# EasyEDA Pro project ProPrj_ESP32辉光钟_2025-08-24.epro, schematic IN12x4CTRL

## Sheets
1 power170VLM3478: Board Name: IN12x4CTRL; Create Date: 2025-08-04; Page Name: power170VLM3478; Project Name: ESP32辉光钟; Schematic Name: IN12x4CTRL; Update Date: 2025-08-04; Add into BOM: yes; Company: Your Company; Convert to PCB: yes; Date: 2023-03-07; Draw By: mkonhy; REV: 1.0; Sheet: 1/1
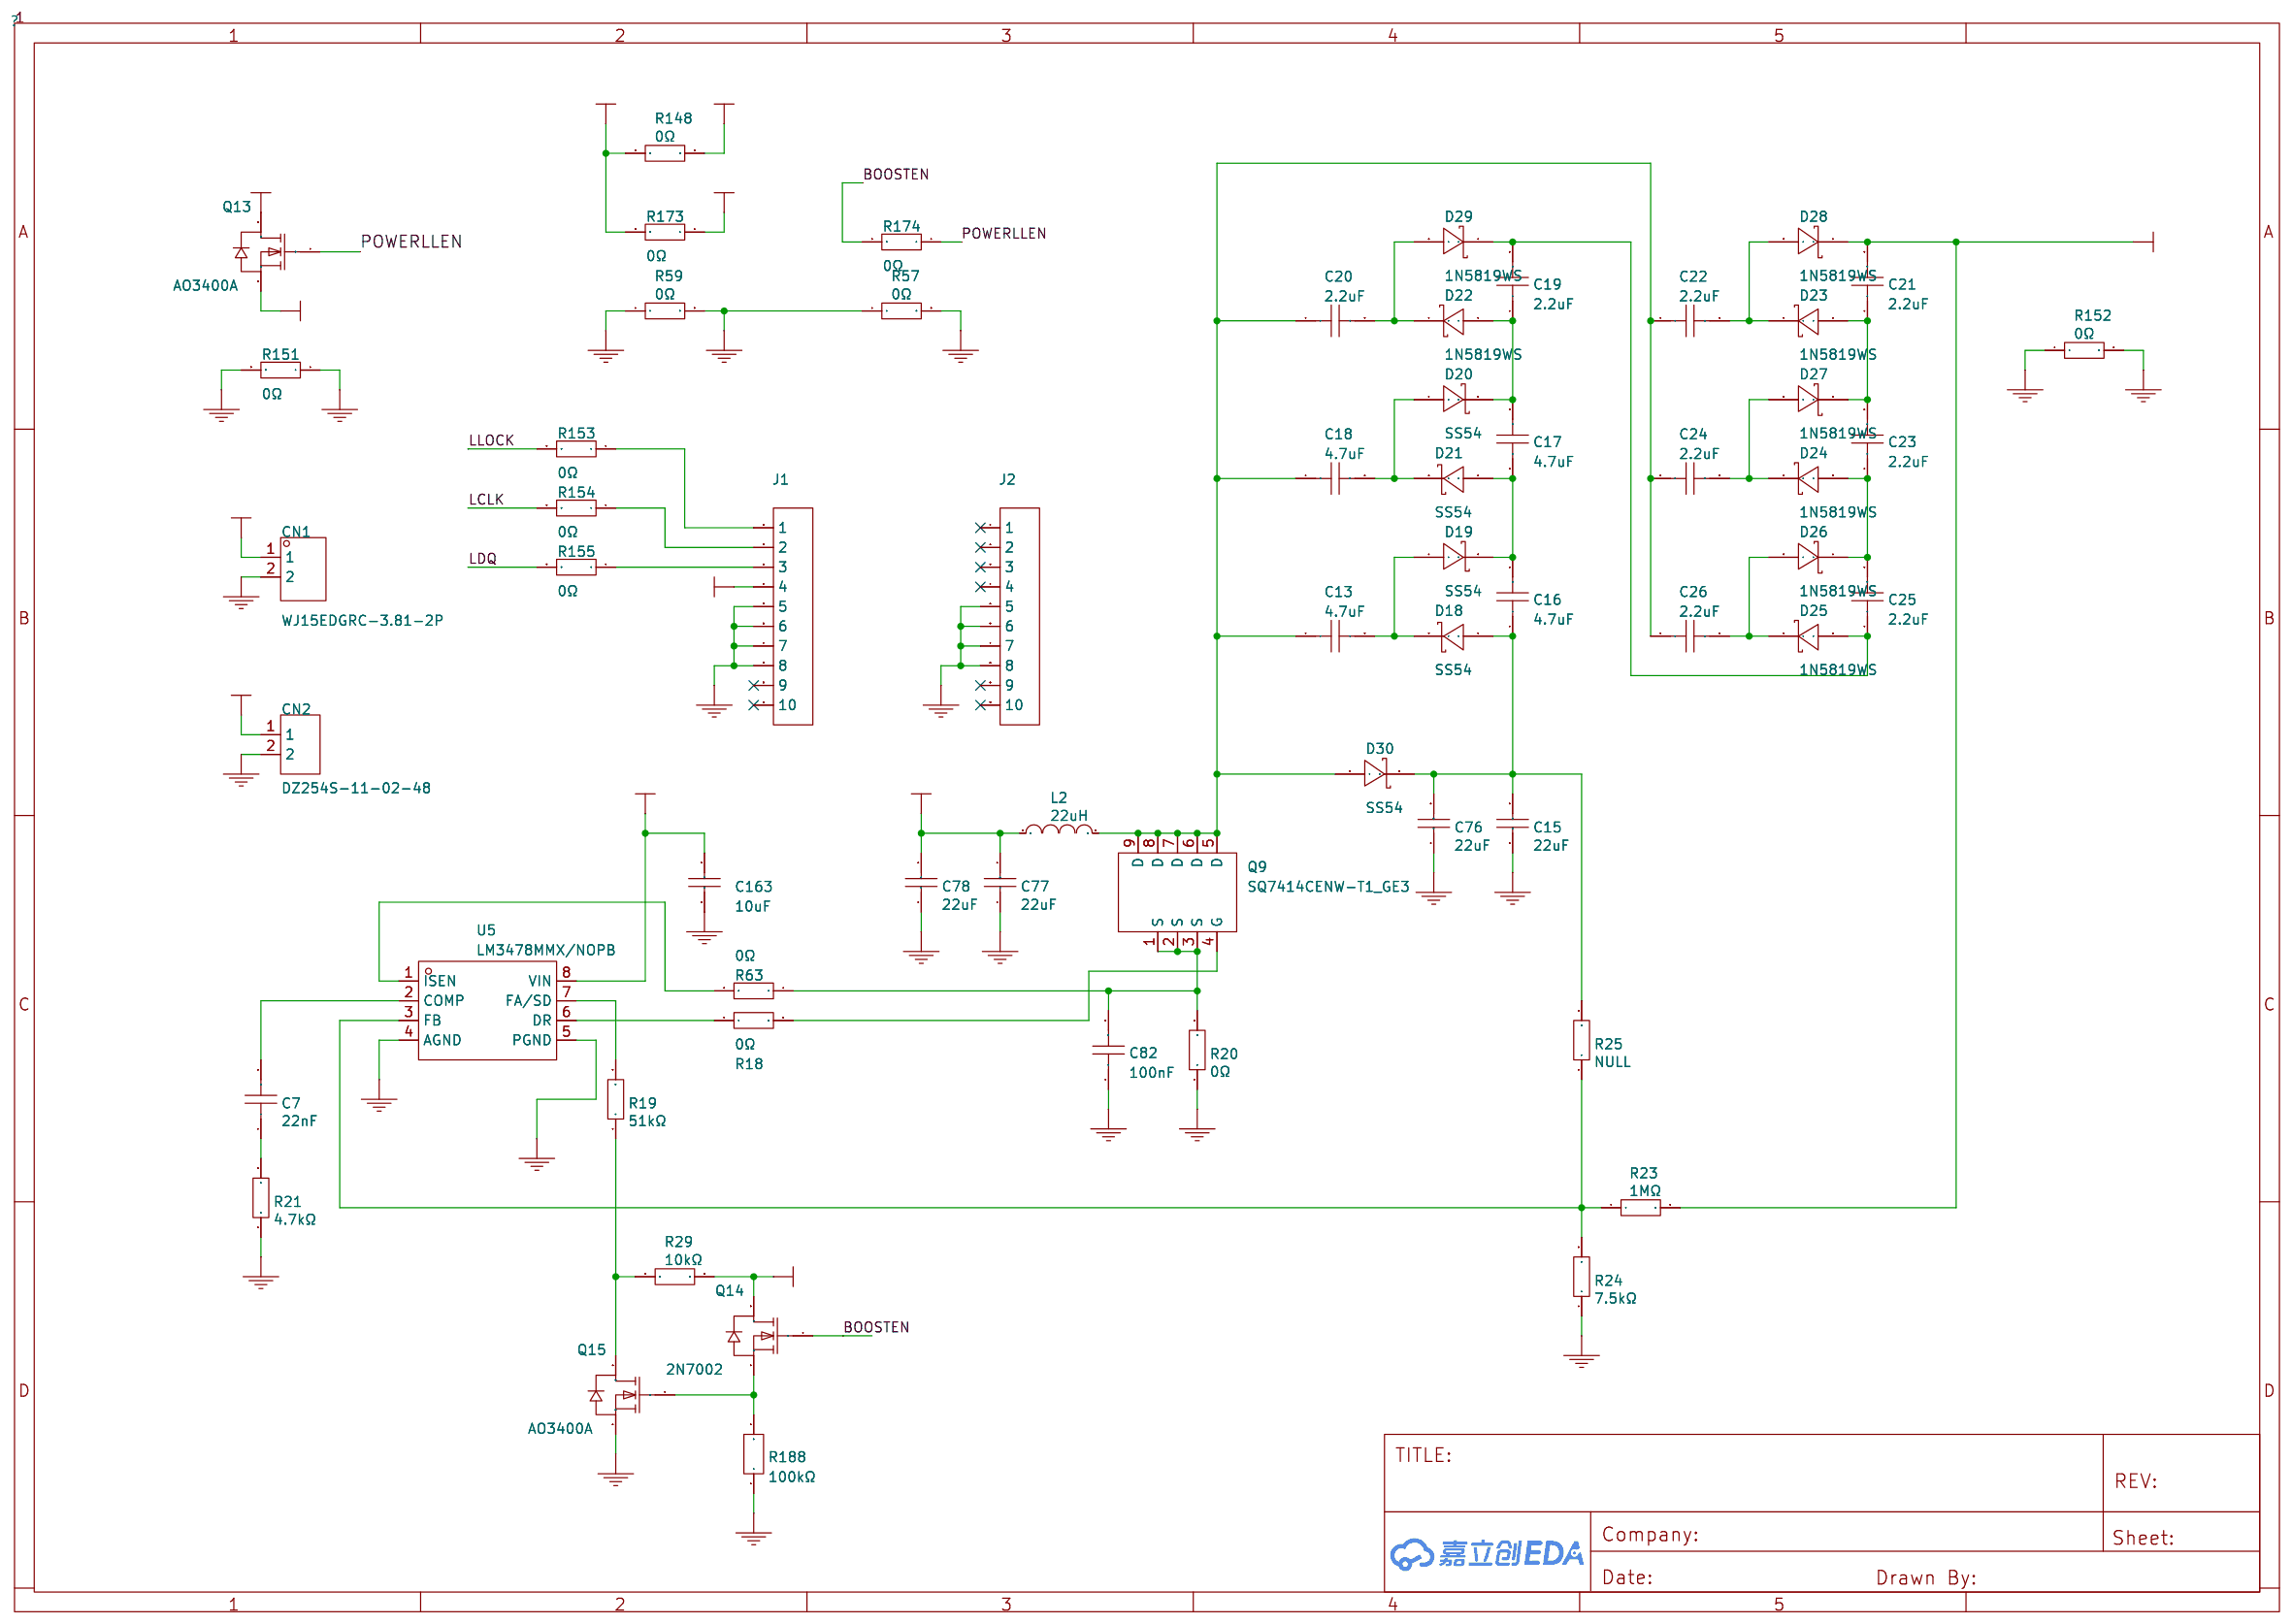
[diagram p2: power170VLM3478]
2 MCUESP32C3FH4: Page Name: MCUESP32C3FH4; Update Date: 2025-08-21; Company: 嘉立创EDA; Page Size: A4; Version: V1.0
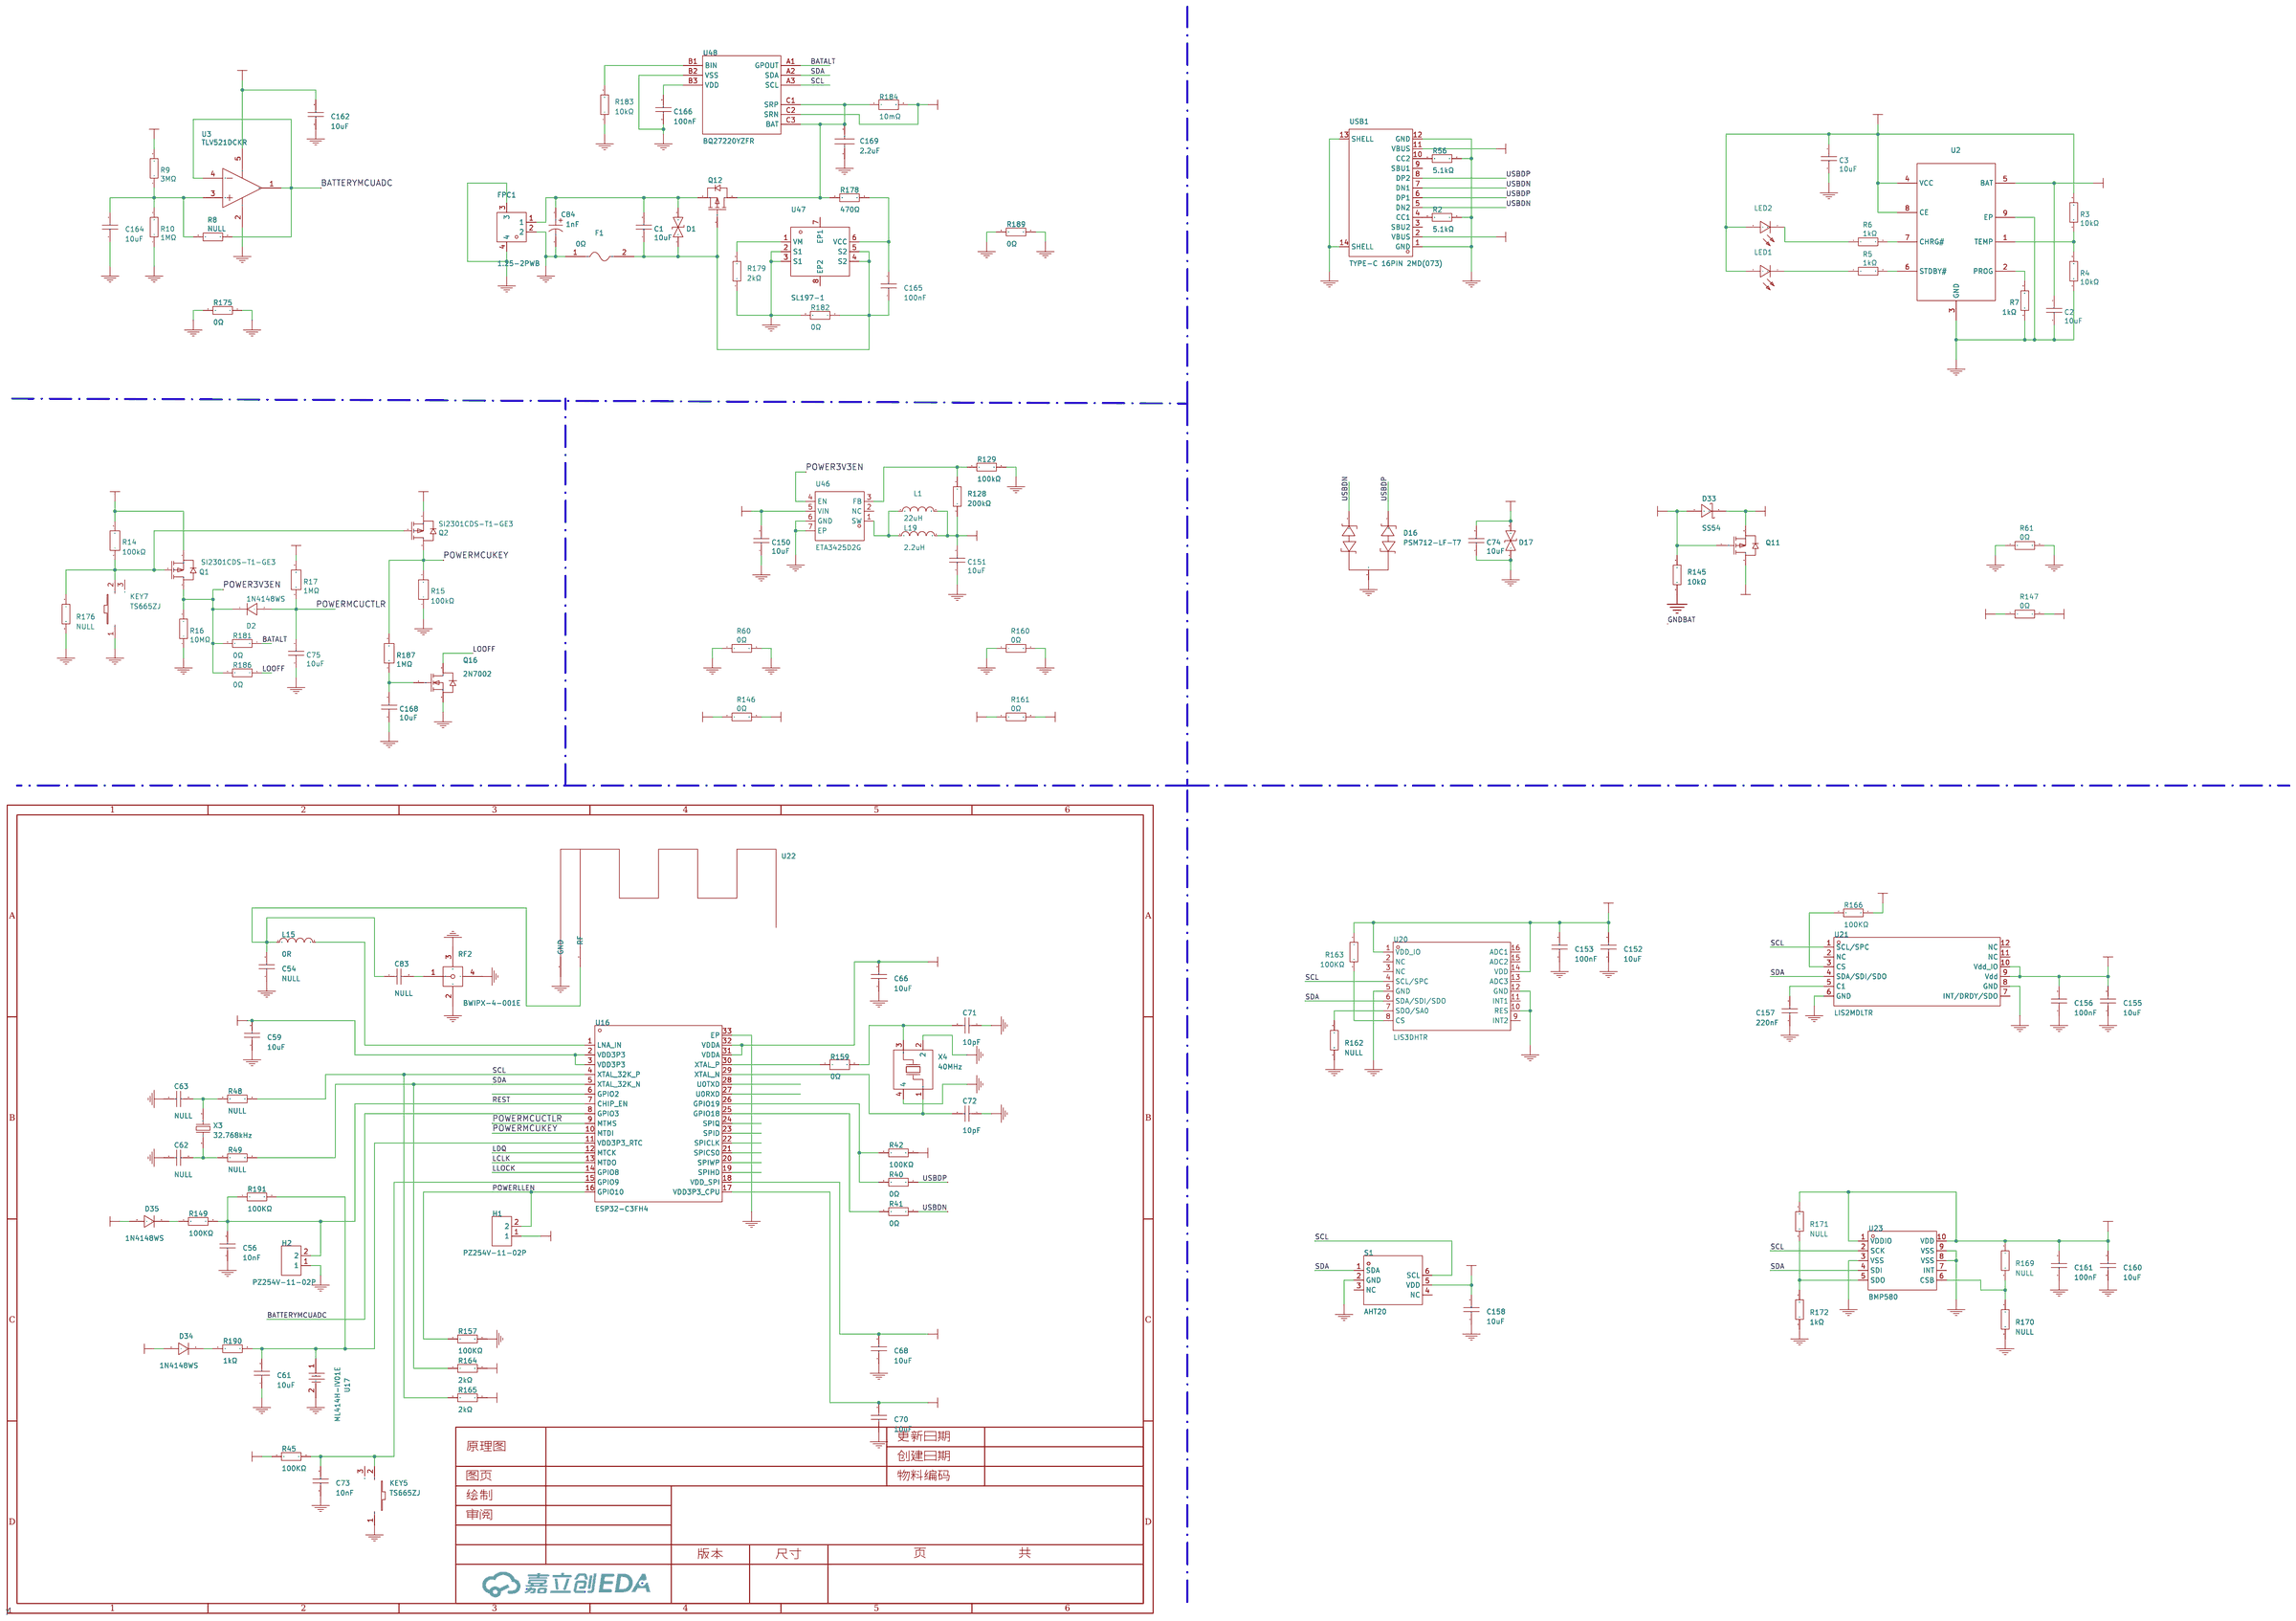
[diagram p3: MCUESP32C3FH4]

## Parts
sheet MCUESP32C3FH4
C1  10uF  [C0603]
C2  10uF  [C0603]
C3  10uF  [C0603]
C54  NULL  [C0402]
C56  10nF  [C0402]
C59  10uF  [C0402]
C61  10uF  [C0402]
C62  NULL  [C0402]
C63  NULL  [C0402]
C66  10uF  [C0402]
C68  10uF  [C0402]
C70  10uF  [C0402]
C71  10pF  [C0402]
C72  10pF  [C0402]
C73  10nF  [C0402]
C74  10uF  [C0603]
C75  10uF  [C0603]
C83  NULL  [C0402]
C84  1nF  [C2211]
C150  10uF  [C0603]
C151  10uF  [C0603]
C152  10uF  [C0402]  (no BOM)
C153  100nF  [C0402]  (no BOM)
C155  10uF  [C0402]  (no BOM)
C156  100nF  [C0402]  (no BOM)
C157  220nF  [C0402]  (no BOM)
C158  10uF  [C0402]
C160  10uF  [C0402]
C161  100nF  [C0402]
C162  10uF  [C0402]  (no BOM)
C164  10uF  [C0402]  (no BOM)
C165  100nF  [C0402]
C166  100nF  [C0402]
C168  10uF  [C0603]
C169  2.2uF  [C0402]
D1  P6SMB6.8CA/TR13  [SMB_L4.6-W3.6-LS5.3-BI]
D2  1N4148WS  [SOD-323_L1.8-W1.3-LS2.5-RD]
D16  PSM712-LF-T7  [SOT-23-3_L3.0-W1.7-P0.95-LS2.9-BR]
D17  P6SMB6.8CA/TR13  [SMB_L4.6-W3.6-LS5.3-BI]
D33  SS54  [SMA_L4.4-W2.8-LS5.4-R-RD]
D34  1N4148WS  [SOD-323_L1.8-W1.3-LS2.5-RD]
D35  1N4148WS  [SOD-323_L1.8-W1.3-LS2.5-RD]
F1  0Ω  [R0603]
FPC1  1.25-2PWB  [CONN-SMD_2P-P1.25_DEALON_1.25-2PWB]
H1  PZ254V-11-02P  [HDR-TH_2P-P2.54-V-M]
H2  PZ254V-11-02P  [HDR-TH_2P-P2.54-V-M]
KEY5  TS665ZJ  [SW-TH_TS665ZJ]
KEY7  TS665ZJ  [SW-TH_TS665ZJ]
L1  22uH  [IND-SMD_L7.8-W7.0_FXC0630]
L15  0R  [L0402]
L19  2.2uH  [L0603]
LED1  A-SP192GW1D-D01-4T  [LED0603-RD]
LED2  KT-0603R  [LED0603-RD]
Q1  SI2301CDS-T1-GE3  [SOT-23-3_L3.0-W1.7-P0.95-LS2.9-BR]
Q2  SI2301CDS-T1-GE3  [SOT-23-3_L3.0-W1.7-P0.95-LS2.9-BR]
Q11  AO3401A  [SOT-23_L2.9-W1.3-P1.90-LS2.4-BR]
Q12  AO3401A  [SOT-23_L2.9-W1.3-P1.90-LS2.4-BR]
Q16  2N7002  [SOT-23-3_L2.9-W1.3-P1.90-LS2.4-BR]
R2  5.1kΩ  [R0402]
R3  10kΩ  [R0402]
R4  10kΩ  [R0402]
R5  1kΩ  [R0402]
R6  1kΩ  [R0402]
R7  1kΩ  [R0402]
R8  NULL  [R0402]  (no BOM)
R9  3MΩ  [R0402]  (no BOM)
R10  1MΩ  [R0402]  (no BOM)
R14  100kΩ  [R0402]
R15  100kΩ  [R0402]
R16  10MΩ  [R0603]
R17  1MΩ  [R0402]
R40  0Ω  [R0402]
R41  0Ω  [R0402]
R42  100KΩ  [R0402]
R45  100KΩ  [R0402]
R48  NULL  [R0402]
R49  NULL  [R0402]
R56  5.1kΩ  [R0402]
R60  0Ω  [R0603]
R61  0Ω  [R0603]
R128  200kΩ  [R0402]
R129  100kΩ  [R0402]
R145  10kΩ  [R0603]
R146  0Ω  [R0603]
R147  0Ω  [R0603]
R149  100KΩ  [R0402]
R157  100KΩ  [R0402]
R159  0Ω  [R0201]
R160  0Ω  [R0603]
R161  0Ω  [R0603]
R162  NULL  [R0402]  (no BOM)
R163  100KΩ  [R0402]  (no BOM)
R164  2kΩ  [R0402]
R165  2kΩ  [R0402]
R166  100KΩ  [R0402]  (no BOM)
R169  NULL  [R0402]
R170  NULL  [R0402]
R171  NULL  [R0402]
R172  1kΩ  [R0402]
R175  0Ω  [R0402]  (no BOM)
R176  NULL  [R0402]
R178  470Ω  [R0402]
R179  2kΩ  [R0402]
R181  0Ω  [R0402]
R182  0Ω  [R0603]
R183  10kΩ  [R0402]
R184  10mΩ  [R0603]
R186  0Ω  [R0402]
R187  1MΩ  [R0402]
R189  0Ω  [R0603]
R190  1kΩ  [R0402]
R191  100KΩ  [R0402]
RF2  BWIPX-4-001E  [IPEX-SMD_BWIPX-4-001E]
S1  AHT20  [SENSOR-SMD_L3.0-W3.0-P1.00-BR]
U2  TP4056-42-ESOP8  [ESOP-8_L4.9-W3.9-P1.27-LS6.0-BL-EP]
U3  TLV521DCKR  [SC-70-5_L2.1-W1.3-P0.65-LS2.1-BR]  (no BOM)
U16  ESP32-C3FH4  [QFN-32_L5.0-W5.0-P0.50-TL-EP3.7]
U17  ML414H-IV01E  [BAT-SMD_ML414H-IV01E]
U20  LIS3DHTR  [LGA-16_L3.0-W3.0-P0.50-TL]  (no BOM)
U21  LIS2MDLTR  [LGA-12_L2.0-W2.0-P0.50-BL]  (no BOM)
U22  -  [2.4G天线]
U23  BMP580  [LGA-10_L2.0-W2.0-P0.50-TL_BMP580]
U46  ETA3425D2G  [TDFN-6_L2.0-W2.0-P0.65-TL-EP]
U47  SL197-1  [DFN-6L_L2.0-W2.0-P0.65-BL_SL197-1]
U48  BQ27220YZFR  [DSBGA-9_L1.7-W1.6-R3-C3-P0.50-BL]
USB1  TYPE-C 16PIN 2MD(073)  [USB-C-SMD_TYPE-C-6PIN-2MD-073]
X3  32.768kHz  [FC-135R_L3.2-W1.5]
X4  40MHz  [CRYSTAL-SMD_4P-L2.5-W2.0-BL]
sheet power170VLM3478
C7  22nF  [C0402]
C13  4.7uF  [C1206]
C15  22uF  [C1206]
C16  4.7uF  [C1206]
C17  4.7uF  [C1206]
C18  4.7uF  [C1206]
C19  2.2uF  [C0805]
C20  2.2uF  [C0805]
C21  2.2uF  [C0805]
C22  2.2uF  [C0805]
C23  2.2uF  [C0805]
C24  2.2uF  [C0805]
C25  2.2uF  [C0805]
C26  2.2uF  [C0805]
C76  22uF  [C1206]
C77  22uF  [C1206]
C78  22uF  [C1206]
C82  100nF  [C0402]
C163  10uF  [C0402]
CN1  WJ15EDGRC-3.81-2P  [CONN-TH_2P-P3.81_WJ15EDGRC-3.81-2P]  (no BOM)
CN2  DZ254S-11-02-48  [HDR-SMD_2P-P2.54_XKB_X6511WVS-02H-C60D48R2]
D18  SS54  [SMA_L4.4-W2.8-LS5.4-R-RD]
D19  SS54  [SMA_L4.4-W2.8-LS5.4-R-RD]
D20  SS54  [SMA_L4.4-W2.8-LS5.4-R-RD]
D21  SS54  [SMA_L4.4-W2.8-LS5.4-R-RD]
D22  1N5819WS  [SOD-323_L1.8-W1.3-LS2.5-RD]
D23  1N5819WS  [SOD-323_L1.8-W1.3-LS2.5-RD]
D24  1N5819WS  [SOD-323_L1.8-W1.3-LS2.5-RD]
D25  1N5819WS  [SOD-323_L1.8-W1.3-LS2.5-RD]
D26  1N5819WS  [SOD-323_L1.8-W1.3-LS2.5-RD]
D27  1N5819WS  [SOD-323_L1.8-W1.3-LS2.5-RD]
D28  1N5819WS  [SOD-323_L1.8-W1.3-LS2.5-RD]
D29  1N5819WS  [SOD-323_L1.8-W1.3-LS2.5-RD]
D30  SS54  [SMA_L4.4-W2.8-LS5.4-R-RD]
J1  2.54-1*10P针  [HDR-TH_10P-P2.54-V-M-1]
J2  2.54-1*10P针  [HDR-TH_10P-P2.54-V-M-1]
L2  22uH  [IND-SMD_L7.8-W7.0_FXC0630]
Q9  SQ7414CENW-T1_GE3  [POWERPAK-1212-8_L3.3-W3.3-P0.65-BL-EP]
Q13  AO3400A  [SOT-23-3_L2.9-W1.3-P1.90-LS2.4-BR]
Q14  2N7002  [SOT-23-3_L2.9-W1.3-P1.90-LS2.4-BR]
Q15  AO3400A  [SOT-23-3_L2.9-W1.3-P1.90-LS2.4-BR]
R18  0Ω  [R0603]
R19  51kΩ  [R0402]
R20  0Ω  [R0805]
R21  4.7kΩ  [R0402]
R23  1MΩ  [R1206]
R24  7.5kΩ  [R0603]
R25  NULL  [R0402]
R29  10kΩ  [R0402]
R57  0Ω  [R0603]
R59  0Ω  [R0603]
R63  0Ω  [R0402]
R148  0Ω  [R0603]
R151  0Ω  [R0603]
R152  0Ω  [R0603]
R153  0Ω  [R0402]
R154  0Ω  [R0402]
R155  0Ω  [R0402]
R173  0Ω  [R0402]
R174  0Ω  [R0402]
R188  100kΩ  [R0402]
U5  LM3478MMX/NOPB  [VSSOP-8_L3.0-W3.0-P0.65-LS5.0-BL]

## Library data of the parts
C1-C3 C74 C75 C150 C151 C168 = CL10A106MA8NRNC: 容值:10uF;精度:±20%;额定电压:25V;材质(温度系数):X5R;; LCSC Part Name: 10uF ±20% 25V; Supplier Part: C96446; Manufacturer: SAMSUNG(三星); Supplier Footprint: 0603; JLCPCB Part Class: Basic Part; Datasheet: https://atta.szlcsc.com/upload/public/pdf/source/20160218/1457707763339.pdf; Supplier: LCSC; Tolerance: ±20%; Voltage Rated: 25V; Temperature Coefficient: X5R
C54 C56 C62 C63 C73 C83 = 0402CG101J500NT: 容值:100pF;精度:±5%;额定电压:50V;材质(温度系数):C0G;; LCSC Part Name: 100pF ±5% 50V; Supplier Part: C1546; Manufacturer: FH(风华); Supplier Footprint: 0402; JLCPCB Part Class: 基础库; Datasheet: https://atta.szlcsc.com/upload/public/pdf/source/20200305/C486355_26A10D38EF8C2A5C37091D0039909270.pdf; Supplier: LCSC; Tolerance: ±5%; Voltage Rated: 50V; Temperature Coefficient: C0G
C59 C61 C66 C68 C70 C152 C155 C158 C160 C162-C164 = CL05A106MQ5NUNC: 容值:10uF;精度:±20%;额定电压:6.3V;材质(温度系数):X5R;; LCSC Part Name: 10uF ±20% 6.3V; Supplier Part: C15525; Manufacturer: SAMSUNG(三星); Supplier Footprint: 0402; JLCPCB Part Class: Basic Part; Datasheet: https://atta.szlcsc.com/upload/public/pdf/source/20220823/2B02EE04F8F211D38A52DCB16EB6BEBA.pdf; Supplier: LCSC; Tolerance: ±20%; Voltage Rated: 6.3V; Temperature Coefficient: X5R
C71 C72 = CL05C100JB5NNNC: 容值:10pF;精度:±5%;额定电压:50V;材质(温度系数):C0G;; LCSC Part Name: 10pF ±5% 50V; Supplier Part: C32949; Manufacturer: SAMSUNG(三星); Supplier Footprint: 0402; JLCPCB Part Class: Basic Part; Datasheet: https://atta.szlcsc.com/upload/public/pdf/source/20160218/1457707763339.pdf; Supplier: LCSC; Tolerance: ±5%; Voltage Rated: 50V; Temperature Coefficient: C0G
C84 = GA352QR7GF102KW01L: 容值:1nF;精度:±10%;电压(AC):250V;等级:X1,Y2;; LCSC Part Name: 等级:X1,Y2 1nF ±10% 250V; Supplier Part: C91599; Manufacturer: muRata(村田); Supplier Footprint: 2211; JLCPCB Part Class: Extended Part; Datasheet: https://atta.szlcsc.com/upload/public/pdf/source/20161226/1482720173745.pdf; Supplier: LCSC; Tolerance: ±10%; Voltage(AC): 250V; Subclass: X1,Y2; Operating Temperature: -55℃~+125℃
C82 C153 C156 C161 C165 C166 = CL05B104KB54PNC: 容值:100nF;精度:±10%;额定电压:50V;材质(温度系数):X7R;; LCSC Part Name: 100nF ±10% 50V; Supplier Part: C307331; Manufacturer: SAMSUNG(三星); Supplier Footprint: 0402; JLCPCB Part Class: Basic Part; Datasheet: https://atta.szlcsc.com/upload/public/pdf/source/20160218/1457707763339.pdf; Supplier: LCSC; Tolerance: ±10%; Voltage Rated: 50V; Temperature Coefficient: X7R
C157 = CL05B224KO5NNNC: 容值:220nF;精度:±10%;额定电压:16V;材质(温度系数):X7R;; LCSC Part Name: 220nF ±10% 16V; Supplier Part: C16772; Manufacturer: SAMSUNG(三星); Supplier Footprint: 0402; JLCPCB Part Class: Basic Part; Datasheet: https://atta.szlcsc.com/upload/public/pdf/source/20160218/1457707763339.pdf; Supplier: LCSC; Tolerance: ±10%; Voltage Rated: 16V; Temperature Coefficient: X7R
C169 = CL05A225MQ5NSNC: 容值:2.2uF;精度:±20%;额定电压:6.3V;材质(温度系数):X5R;; LCSC Part Name: 2.2uF ±20% 6.3V; Supplier Part: C12530; Manufacturer: SAMSUNG(三星); Supplier Footprint: 0402; JLCPCB Part Class: 基础库; Datasheet: https://atta.szlcsc.com/upload/public/pdf/source/20160218/1457707763339.pdf; Supplier: LCSC; Tolerance: ±20%; Voltage Rated: 6.3V; Temperature Coefficient: X5R
D1 D17 = P6SMB6.8CA/TR13: 反向截止电压(Vrwm):5.8V;最大钳位电压:10.5V;峰值脉冲电流(Ipp)@10/1000us:58.1A;峰值脉冲功率(Ppp)@10/1000us:600W;击穿电压:6.45V;; Supplier Part: C78395; Manufacturer: Brightking(君耀电子); Supplier Footprint: SMB(DO-214AA); JLCPCB Part Class: Basic Part; Datasheet: https://atta.szlcsc.com/upload/public/pdf/source/20160709/1468031879762.pdf; Supplier: LCSC; Reverse Stand-Off Voltage (Vrwm): 5.8V; Maximum Clamping Voltage: 10.5V; Peak Pulse Current (Ipp)@10/1000us: 58.1A; Peak Pulse Power Dissipation (Ppp)@10/1000us: 600W; Breakdown Voltage: 6.45V; Type: TVS
D2 D34 D35 = 1N4148WS_C2128: 二极管配置:独立式;正向压降(Vf):1.25V@150mA;直流反向耐压(Vr):100V;平均整流电流(Io):150mA;功率:200mW;反向恢复时间(trr):4ns;; LCSC Part Name: 电压:100V 电流:150mA; Supplier Part: C2128; Manufacturer: CJ(江苏长电/长晶); Supplier Footprint: SOD-323; JLCPCB Part Class: Basic Part; Datasheet: https://atta.szlcsc.com/upload/public/pdf/source/20140809/1457707208178.pdf; Supplier: LCSC; Diode Configuration: 独立式; Forward Voltage (Vf@If): 1.25V@150mA; Reverse Voltage (Vr): 100V; Average Rectified Current (Io): 150mA; Power Dissipation: 200mW; Reverse Leakage Current: 1uA@75V; Reverse Recovery Time (trr): 4ns
D16 = PSM712-LF-T7: 反向截止电压(Vrwm):12V;最大钳位电压:19V;击穿电压:13.3V;; Supplier Part: C32677; Manufacturer: PROTEK; Supplier Footprint: SOT-23; JLCPCB Part Class: 基础库; Datasheet: https://atta.szlcsc.com/upload/public/pdf/source/20140717/1457707154667.pdf; Supplier: LCSC; Reverse Stand-Off Voltage (Vrwm): 12V; Maximum Clamping Voltage: 19V; Breakdown Voltage: 13.3V; Type: TVS
D18-D21 D30 D33 = SS54_C22452: 二极管配置:独立式;正向压降(Vf):550mV@5A;直流反向耐压(Vr):40V;整流电流:5A;; LCSC Part Name: 电压:40V 电流:5A; Supplier Part: C22452; Manufacturer: MDD(辰达半导体); Supplier Footprint: SMA(DO-214AC); JLCPCB Part Class: 基础库; Datasheet: https://atta.szlcsc.com/upload/public/pdf/source/20230314/529CD85F9B31F69841D3A079BC07E377.pdf; Supplier: LCSC; Diode Configuration: 独立式; Forward Voltage (Vf@If): 550mV@5A; Reverse Voltage (Vr): 40V; Rectified Current: 5A; Reverse Leakage Current (Ir): 1mA@40V
F1 = 0603WAF0000T5E: 电阻类型:厚膜电阻;阻值:0Ω;精度:±1%;功率:100mW;工作电压:75V;; LCSC Part Name: 0Ω ±1% 100mW 厚膜电阻; Supplier Part: C21189; Manufacturer: UNI-ROYAL(厚声); Supplier Footprint: 0603; JLCPCB Part Class: Basic Part; Datasheet: https://atta.szlcsc.com/upload/public/pdf/source/20200306/C422600_1E6D84923E4A46A82E41ADD87F860B5C.pdf; Supplier: LCSC; Type: 厚膜电阻; Tolerance: ±1%; Power(Watts): 100mW; Overload Voltage (Max): 75V; Operating Temperature Range: -55℃~+155℃; Voltage-Supply(Max): 75V; Operating Temperature: -55℃~+155℃
FPC1 = 1.25-2PWB: 插针结构:1x2P;间距:1.25mm;安装方式:卧贴;参考系列:-;总PIN数:2P;排数:1;每排PIN数:2;行距:-;额定电流:-;工作温度范围:-40℃~+85℃;; LCSC Part Name: 1x2P 间距:1.25mm 卧贴; Supplier Part: C2905009; Manufacturer: DEALON(德艺隆); Supplier Footprint: SMD,P=1.25mm,卧贴; JLCPCB Part Class: 扩展库; Datasheet: https://atta.szlcsc.com/upload/public/pdf/source/20231123/1AE0876AE9C7DCFC0D68EAC4CBA881B0.pdf; Supplier: LCSC; Pins Structure: 1x2P; Pitch: 1.25mm; Mounting Style: 卧贴; Number of Pins: 2P; Number of Rows: 1; Number of PINs Per Row: 2; Operating Temperature Range: -40℃~+85℃
H1 H2 = PZ254V-11-02P: 插针结构:1x2P;间距:2.54mm;行距:-;圆针/方针:方针;安装类型:直插;排数:单排;总PIN位数:2P;额定电流:-;额定电压:-;配合针长度:6mm;塑高:2.5mm;端接针长度:3mm;触头材质:黄铜;触头镀层:-;工作温度范围:-40℃~+105℃;颜色:黑色;; LCSC Part Name: 间距:2.54mm 1x2P 直插 方针; Supplier Part: C492401; Manufacturer: XFCN(兴飞); Supplier Footprint: 插件,P=2.54mm; JLCPCB Part Class: Extended Part; Datasheet: https://atta.szlcsc.com/upload/public/pdf/source/20200309/C492401_A812433581A9B211A7FFA413ADDFF0E5.pdf; Supplier: LCSC; Pin Structure: 1x2P; Pitch: 2.54mm; Circluar Pins/Square Pins: 方针; Mounting Type: 直插; Number of Rows: 单排; Number of Pins: 2P; Length of Mating Pin: 6mm; Insulation Height: 2.5mm; Length of End Connection Pin: 3mm; Contact Material: 黄铜; Operating Temperature Range: -40℃~+105℃; Color: 黑色
KEY5 KEY7 = TS665ZJ: 电路结构:单刀单掷;按钮形状:圆形按钮;作用力:250gf;安装方式:卧插;开关长度:6.2mm;开关宽度:6.2mm;开关高度:5mm;带支架:带支架;触点电流:50mA;额定电压(DC):12V;绝缘电阻:100MΩ;机械寿命:5万次;; LCSC Part Name: 6.2*6.2*5mm 卧插 轻触开关; Supplier Part: C557599; Manufacturer: SHOU HAN(首韩); Supplier Footprint: 插件; JLCPCB Part Class: Extended Part; Datasheet: https://atta.szlcsc.com/upload/public/pdf/source/20200519/C557599_C93058E34E1879225DC935A3AAEF7EAA.pdf; Supplier: LCSC; Circuit: 单刀单掷; Actuator Style: 圆形按钮; Operating Force: 250gf; Mounting Style: 卧插; Switch Length: 6.2mm; Switch Width: 6.2mm; Switch Height: 5mm; Strike Gundam: 带支架; Contact Current: 50mA; Voltage Rating (DC): 12V; Insulation Resistance: 100MΩ; Actuator/Cap Color: 黑色; Pin Style: PC引脚; Mechanical Life: 5万次
L1 L2 = FXC0630-220M: 电感值:22uH;精度:±20%;额定电流:2A;饱和电流(Isat):3.5A;类型:一体成型电感;; LCSC Part Name: 22uH ±20% 3.5A; Supplier Part: C208103; Manufacturer: cjiang(长江微电); Supplier Footprint: SMD,6.6x7.3mm; JLCPCB Part Class: Extended Part; Datasheet: https://atta.szlcsc.com/upload/public/pdf/source/20230516/161B026EB2AA79E989878650F338970F.pdf; Supplier: LCSC; Tolerance: ±20%; Rated Current: 2A; Saturation Current (Isat): 3.5A; DC Resistance (DCR): 190mΩ; Type: 一体成型电感
L15 = LQP15MN2N0B02D: 电感值:2nH;精度:-;额定电流:220mA;饱和电流(Isat):-;直流电阻(DCR):300mΩ;; LCSC Part Name: 2nH; Supplier Part: C91619; Manufacturer: muRata(村田); Supplier Footprint: 0402; JLCPCB Part Class: 扩展库; Datasheet: https://atta.szlcsc.com/upload/public/pdf/source/20161226/1482720178678.pdf; Supplier: LCSC; Rated Current: 220mA; DC Resistance (DCR): 300mΩ; Q @ Freq: 13@500MHz; Frequency - Self Resonant: 6GHz
L19 = CMH160808B2R2MT: 电感值:2.2uH;精度:±20%;额定电流:750mA;; LCSC Part Name: 2.2uH ±20%; Supplier Part: C394950; Manufacturer: FH(风华); Supplier Footprint: 0603; JLCPCB Part Class: Extended Part; Datasheet: https://atta.szlcsc.com/upload/public/pdf/source/20230223/142B566F7A79878A07A1E031813F1064.pdf; Supplier: LCSC; Tolerance: ±20%; Rated Current: 750mA; DC Resistance (DCR): 240mΩ; Ratings: AEC-Q200
LED1 = A-SP192GW1D-D01-4T: 发光颜色:白色;正向电压(VF):2.5V~2.9V;功率:95mW;透镜颜色:-;发光强度:57mcd~225mcd;发光角度:130°;载带方式:正贴;工作温度:-40℃~+85℃;; LCSC Part Name: 0603白光正贴（正白偏冷）; Supplier Part: C19171285; Manufacturer: Amicc(欧密格光电); Supplier Footprint: 0603; JLCPCB Part Class: Extended Part; Datasheet: https://atta.szlcsc.com/upload/public/pdf/source/20231108/C509B7BEC9EA0B1CC79F1E6D714E882A.pdf; Supplier: LCSC; Emitted Color: 白色; Forward Voltage (VF): 2.5V~2.9V; Power Dissipation: 95mW; Luminous Intensity: 57mcd~225mcd; Viewing Angle: 130°; Mounting Sytle: 正贴; Operating Temperature: -40℃~+85℃
LED2 = KT-0603R: 发光颜色:红色;功率:-;正向电流:-;主波长:-;二极管配置:-;透镜颜色:-;色温:-;发光角度:-;载带方式:-;工作温度:-40℃~+85℃;; LCSC Part Name: 0603 红灯 高亮; Supplier Part: C2286; Manufacturer: KENTO; Supplier Footprint: 0603; JLCPCB Part Class: Basic Part; Datasheet: https://atta.szlcsc.com/upload/public/pdf/source/20160616/1466072038404.pdf; Supplier: LCSC; Emitted Color: 红色; Operating Temperature: -40℃~+85℃
Q1 Q2 = SI2301CDS-T1-GE3: 数量:1个P沟道;漏源电压(Vdss):20V;连续漏极电流(Id):2.3A;导通电阻(RDS(on)):112mΩ@4.5V,2.8A;耗散功率(Pd):860mW;阈值电压(Vgs(th)):1V;; LCSC Part Name: 1个P沟道 耐压:20V 电流:3.1A; Supplier Part: C10487; Manufacturer: VISHAY(威世); Supplier Footprint: SOT-23; JLCPCB Part Class: Basic Part; Datasheet: https://atta.szlcsc.com/upload/public/pdf/source/20180621/C10487_757133A2CC00440C4C7DD3E7E73681E9.pdf; Supplier: LCSC; Type: 1个P沟道; Drain Source Voltage (Vdss): 20V; Continuous Drain Current (Id): 3.1A; Power Dissipation (Pd): 860mW；1.6W; Drain Source On Resistance (RDS(on)@Vgs,Id): 112mΩ@4.5V,2.8A; Gate Threshold Voltage (Vgs(th)@Id): 1V@250uA; Total Gate Charge (Qg@Vgs): 10nC@4.5V; Input Capacitance (Ciss@Vds): 405pF@10V; Operating Temperature: -55℃~+150℃@(Tj); Number: 1个P沟道; Drain to Source Voltage: 20V; Current - Continuous Drain(Id): 2.3A; RDS(on): 112mΩ@4.5V,2.8A; Pd - Power Dissipation: 860mW; Gate Charge(Qg): 3.3nC@10V; Input Capacitance(Ciss@Vds): 405pF@10V
Q11 Q12 = AO3401A_C15127: 类型:1个P沟道;漏源电压(Vdss):30V;连续漏极电流(Id):4A;导通电阻(RDS(on)@Vgs,Id):44mΩ@10V,4.3A;功率(Pd):1.4W;阈值电压(Vgs(th)@Id):1.3V@250uA;; LCSC Part Name: 1个P沟道 耐压:30V 电流:4A; Supplier Part: C15127; Manufacturer: AOS; Supplier Footprint: SOT-23; JLCPCB Part Class: 基础库; Datasheet: https://atta.szlcsc.com/upload/public/pdf/source/20160507/1462613609053.pdf; Supplier: LCSC; Type: 1个P沟道; Drain Source Voltage (Vdss): 30V; Continuous Drain Current (Id): 4A; Drain Source On Resistance (RDS(on)@Vgs,Id): 44mΩ@10V,4.3A; Power Dissipation (Pd): 1.4W; Gate Threshold Voltage (Vgs(th)@Id): 1.3V@250uA; Total Gate Charge (Qg@Vgs): 12.2nC@4.5V; Input Capacitance (Ciss@Vds): 1.2nF@15V; Operating Temperature: -55℃~+150℃@(Tj); Standardization Check: true
Q16 = 2N7002_C8545: 类型:N沟道;漏源电压(Vdss):60V;连续漏极电流(Id):115mA;功率(Pd):200mW;导通电阻(RDS(on)@Vgs,Id):7.5Ω@10V,500mA;阈值电压(Vgs(th)@Id):2.5V@250uA;; LCSC Part Name: N沟道 耐压:60V 电流:115mA; Supplier Part: C8545; Manufacturer: CJ(江苏长电/长晶); Supplier Footprint: SOT-23; JLCPCB Part Class: 基础库; Datasheet: https://atta.szlcsc.com/upload/public/pdf/source/20171228/C164913_15144413269051213916.pdf; Supplier: LCSC; Type: N沟道; Drain Source Voltage (Vdss): 60V; Continuous Drain Current (Id): 115mA; Power Dissipation (Pd): 200mW; Drain Source On Resistance (RDS(on)@Vgs,Id): 7.5Ω@10V,500mA; Gate Threshold Voltage (Vgs(th)@Id): 2.5V@250uA
R2 R56 = 0402WGF5101TCE: 电阻类型:厚膜电阻;阻值:5.1kΩ;精度:±1%;功率:62.5mW;最大工作电压:50V;温度系数:±100ppm/℃;; LCSC Part Name: 5.1kΩ ±1% 62.5mW 厚膜电阻; Supplier Part: C25905; Manufacturer: UNI-ROYAL(厚声); Supplier Footprint: 0402; JLCPCB Part Class: Basic Part; Datasheet: https://atta.szlcsc.com/upload/public/pdf/source/20200306/C422600_1E6D84923E4A46A82E41ADD87F860B5C.pdf; Supplier: LCSC; Type: 厚膜电阻; Tolerance: ±1%; Power(Watts): 62.5mW; Overload Voltage (Max): 50V; Temperature Coefficient: ±100ppm/℃; Operating Temperature Range: -55℃~+155℃
R3 R4 R29 R183 = 0402WGF1002TCE: 电阻类型:厚膜电阻;阻值:10kΩ;精度:±1%;功率:62.5mW;最大工作电压:50V;温度系数:±100ppm/℃;; LCSC Part Name: 10kΩ ±1% 62.5mW 厚膜电阻; Supplier Part: C25744; Manufacturer: UNI-ROYAL(厚声); Supplier Footprint: 0402; JLCPCB Part Class: Basic Part; Datasheet: https://atta.szlcsc.com/upload/public/pdf/source/20200306/C422600_1E6D84923E4A46A82E41ADD87F860B5C.pdf; Supplier: LCSC; Type: 厚膜电阻; Tolerance: ±1%; Power(Watts): 62.5mW; Overload Voltage (Max): 50V; Temperature Coefficient: ±100ppm/℃; Operating Temperature Range: -55℃~+155℃
R5-R7 = 0402WGF1001TCE: 电阻类型:厚膜电阻;阻值:1kΩ;精度:±1%;功率:62.5mW;最大工作电压:50V;温度系数:±100ppm/℃;; LCSC Part Name: 1kΩ ±1% 62.5mW 厚膜电阻; Supplier Part: C11702; Manufacturer: UNI-ROYAL(厚声); Supplier Footprint: 0402; JLCPCB Part Class: Basic Part; Datasheet: https://atta.szlcsc.com/upload/public/pdf/source/20200306/C422600_1E6D84923E4A46A82E41ADD87F860B5C.pdf; Supplier: LCSC; Type: 厚膜电阻; Tolerance: ±1%; Power(Watts): 62.5mW; Overload Voltage (Max): 50V; Temperature Coefficient: ±100ppm/℃; Operating Temperature Range: -55℃~+155℃
R8 = AC0402FR-071ML: Supplier: LCSC; Manufacturer: YAGEO(国巨); Supplier Part: C144787; JLCPCB Part Class: Extended Part; Resistance: 1MΩ
R9 = 0402WGF3004TCE: 电阻类型:厚膜电阻;阻值:3MΩ;精度:±1%;功率:62.5mW;最大工作电压:50V;温度系数:±100ppm/℃;; LCSC Part Name: 3MΩ ±1% 62.5mW 厚膜电阻; Supplier Part: C56582; Manufacturer: UNI-ROYAL(厚声); Supplier Footprint: 0402; JLCPCB Part Class: Extended Part; Datasheet: https://atta.szlcsc.com/upload/public/pdf/source/20200306/C422600_1E6D84923E4A46A82E41ADD87F860B5C.pdf; Supplier: LCSC; Type: 厚膜电阻; Tolerance: ±1%; Power(Watts): 62.5mW; Overload Voltage (Max): 50V; Temperature Coefficient: ±100ppm/℃; Operating Temperature Range: -55℃~+155℃; Resistance: 3M
R10 R17 R187 = 0402WGF1004TCE: 电阻类型:厚膜电阻;阻值:1MΩ;精度:±1%;功率:62.5mW;最大工作电压:50V;温度系数:±100ppm/℃;; LCSC Part Name: 1MΩ ±1% 62.5mW 厚膜电阻; Supplier Part: C26083; Manufacturer: UNI-ROYAL(厚声); Supplier Footprint: 0402; JLCPCB Part Class: Basic Part; Datasheet: https://atta.szlcsc.com/upload/public/pdf/source/20200306/C422600_1E6D84923E4A46A82E41ADD87F860B5C.pdf; Supplier: LCSC; Type: 厚膜电阻; Tolerance: ±1%; Power(Watts): 62.5mW; Overload Voltage (Max): 50V; Temperature Coefficient: ±100ppm/℃; Operating Temperature Range: -55℃~+155℃
R14 R15 R129 R188 = 0402WGF1003TCE: 电阻类型:厚膜电阻;阻值:100kΩ;精度:±1%;功率:62.5mW;最大工作电压:50V;温度系数:±100ppm/℃;; LCSC Part Name: 100kΩ ±1% 62.5mW 厚膜电阻; Supplier Part: C25741; Manufacturer: UNI-ROYAL(厚声); Supplier Footprint: 0402; JLCPCB Part Class: Basic Part; Datasheet: https://atta.szlcsc.com/upload/public/pdf/source/20200306/C422600_1E6D84923E4A46A82E41ADD87F860B5C.pdf; Supplier: LCSC; Type: 厚膜电阻; Tolerance: ±1%; Power(Watts): 62.5mW; Overload Voltage (Max): 50V; Temperature Coefficient: ±100ppm/℃; Operating Temperature Range: -55℃~+155℃
R16 = 0603WAF1005T5E: 电阻类型:厚膜电阻;阻值:10MΩ;精度:±1%;功率:100mW;最大工作电压:75V;温度系数:±100ppm/℃;; LCSC Part Name: 10MΩ ±1% 100mW 厚膜电阻; Supplier Part: C7250; Manufacturer: UNI-ROYAL(厚声); Supplier Footprint: 0603; JLCPCB Part Class: Basic Part; Datasheet: https://atta.szlcsc.com/upload/public/pdf/source/20200306/C422600_1E6D84923E4A46A82E41ADD87F860B5C.pdf; Supplier: LCSC; Type: 厚膜电阻; Tolerance: ±1%; Power(Watts): 100mW; Overload Voltage (Max): 75V; Temperature Coefficient: ±100ppm/℃; Operating Temperature Range: -55℃~+155℃
R40-R42 R45 R48 R49 R149 R153-R155 R157 R163 R166 R175 R176 R181 R186 R191 = 0402WGF1004TCE: 电阻类型:厚膜电阻;阻值:1MΩ;精度:±1%;功率:62.5mW;最大工作电压:50V;温度系数:±100ppm/℃;; LCSC Part Name: 1MΩ ±1% 62.5mW 厚膜电阻; Supplier Part: C26083; Manufacturer: UNI-ROYAL(厚声); Supplier Footprint: 0402; JLCPCB Part Class: 基础库; Datasheet: https://atta.szlcsc.com/upload/public/pdf/source/20200306/C422600_1E6D84923E4A46A82E41ADD87F860B5C.pdf; Supplier: LCSC; Type: 厚膜电阻; Tolerance: ±1%; Power(Watts): 62.5mW; Overload Voltage (Max): 50V; Temperature Coefficient: ±100ppm/℃; Operating Temperature Range: -55℃~+155℃
R18 R57 R59-R61 R146-R148 R151 R152 R160 R161 R182 R189 = 0603WAF0000T5E: 电阻类型:厚膜电阻;阻值:0Ω;精度:±1%;功率:100mW;最大工作电压:75V;; LCSC Part Name: 0Ω ±1% 100mW 厚膜电阻; Supplier Part: C21189; Manufacturer: UNI-ROYAL(厚声); Supplier Footprint: 0603; JLCPCB Part Class: Basic Part; Datasheet: https://atta.szlcsc.com/upload/public/pdf/source/20200306/C422600_1E6D84923E4A46A82E41ADD87F860B5C.pdf; Supplier: LCSC; Type: 厚膜电阻; Tolerance: ±1%; Power(Watts): 100mW; Overload Voltage (Max): 75V; Operating Temperature Range: -55℃~+155℃; Resistance: 1
R128 = 0402WGF2003TCE: 电阻类型:厚膜电阻;阻值:200kΩ;精度:±1%;功率:62.5mW;最大工作电压:50V;温度系数:±100ppm/℃;; LCSC Part Name: 200kΩ ±1% 62.5mW 厚膜电阻; Supplier Part: C25764; Manufacturer: UNI-ROYAL(厚声); Supplier Footprint: 0402; JLCPCB Part Class: 基础库; Datasheet: https://atta.szlcsc.com/upload/public/pdf/source/20200306/C422600_1E6D84923E4A46A82E41ADD87F860B5C.pdf; Supplier: LCSC; Type: 厚膜电阻; Tolerance: ±1%; Power(Watts): 62.5mW; Overload Voltage (Max): 50V; Temperature Coefficient: ±100ppm/℃; Operating Temperature Range: -55℃~+155℃
R145 = 0603WAF1002T5E: 电阻类型:厚膜电阻;阻值:10kΩ;精度:±1%;功率:100mW;温度系数:±100ppm/℃;最大工作电压:75V;工作温度范围:-55℃~+155℃;; LCSC Part Name: 10kΩ ±1% 100mW; Supplier Part: C25804; Manufacturer: UNI-ROYAL(厚声); Supplier Footprint: 0603; JLCPCB Part Class: 基础库; Datasheet: https://atta.szlcsc.com/upload/public/pdf/source/20200306/C422600_1E6D84923E4A46A82E41ADD87F860B5C.pdf; Supplier: LCSC; Type: 厚膜电阻; Tolerance: ±1%; Power(Watts): 100mW; Temperature Coefficient: ±100ppm/℃; Overload Voltage (Max): 75V; Operating Temperature Range: -55℃~+155℃; Standardization Check: true
R159 = 0201WMF0000TEE: 电阻类型:厚膜电阻;阻值:0Ω;精度:±1%;功率:50mW;最大工作电压:25V;; LCSC Part Name: 0Ω ±1% 50mW 厚膜电阻; Supplier Part: C473473; Manufacturer: UNI-ROYAL(厚声); Supplier Footprint: 0201; JLCPCB Part Class: 扩展库; Datasheet: https://atta.szlcsc.com/upload/public/pdf/source/20200306/C422600_1E6D84923E4A46A82E41ADD87F860B5C.pdf; Supplier: LCSC; Type: 厚膜电阻; Tolerance: ±1%; Power(Watts): 50mW; Overload Voltage (Max): 25V; Operating Temperature Range: -55℃~+155℃
R162 R169-R171 = 0402WGJ0104TCE: 电阻类型:厚膜电阻;阻值:100kΩ;精度:±5%;功率:62.5mW;最大工作电压:50V;温度系数:±100ppm/℃;; LCSC Part Name: 100kΩ ±5% 62.5mW 厚膜电阻; Supplier Part: C25530; Manufacturer: UNI-ROYAL(厚声); Supplier Footprint: 0402; JLCPCB Part Class: Extended Part; Datasheet: https://atta.szlcsc.com/upload/public/pdf/source/20200306/C422600_1E6D84923E4A46A82E41ADD87F860B5C.pdf; Supplier: LCSC; Type: 厚膜电阻; Tolerance: ±5%; Power(Watts): 62.5mW; Overload Voltage (Max): 50V; Temperature Coefficient: ±100ppm/℃; Operating Temperature Range: -55℃~+155℃
R164 R165 = 0402WGF2001TCE: 电阻类型:厚膜电阻;阻值:2kΩ;精度:±1%;功率:62.5mW;最大工作电压:50V;温度系数:±100ppm/℃;; LCSC Part Name: 2kΩ ±1% 62.5mW 厚膜电阻; Supplier Part: C4109; Manufacturer: UNI-ROYAL(厚声); Supplier Footprint: 0402; JLCPCB Part Class: Basic Part; Datasheet: https://atta.szlcsc.com/upload/public/pdf/source/20200306/C422600_1E6D84923E4A46A82E41ADD87F860B5C.pdf; Supplier: LCSC; Type: 厚膜电阻; Tolerance: ±1%; Power(Watts): 62.5mW; Overload Voltage (Max): 50V; Temperature Coefficient: ±100ppm/℃; Operating Temperature Range: -55℃~+155℃
R172 R190 = 0402WGF1001TCE: 电阻类型:厚膜电阻;阻值:1kΩ;精度:±1%;功率:62.5mW;工作电压:50V;温度系数:±100ppm/℃;; LCSC Part Name: 1kΩ ±1% 62.5mW 厚膜电阻; Supplier Part: C11702; Manufacturer: UNI-ROYAL(厚声); Supplier Footprint: 0402; JLCPCB Part Class: Basic Part; Datasheet: https://item.szlcsc.com/datasheet/0402WGF1001TCE/12256.html; Supplier: LCSC; Type: 厚膜电阻; Tolerance: ±1%; Power(Watts): 62.5mW; Overload Voltage (Max): 50V; Temperature Coefficient: ±100ppm/℃; Operating Temperature Range: -55℃~+155℃; Voltage-Supply(Max): 50V; Operating Temperature: -55℃~+155℃
R178 = 0402WGF4700TCE: 电阻类型:厚膜电阻;阻值:470Ω;精度:±1%;功率:62.5mW;最大工作电压:50V;温度系数:±100ppm/℃;; LCSC Part Name: 470Ω ±1% 62.5mW 厚膜电阻; Supplier Part: C25117; Manufacturer: UNI-ROYAL(厚声); Supplier Footprint: 0402; JLCPCB Part Class: 基础库; Datasheet: https://atta.szlcsc.com/upload/public/pdf/source/20200306/C422600_1E6D84923E4A46A82E41ADD87F860B5C.pdf; Supplier: LCSC; Type: 厚膜电阻; Tolerance: ±1%; Power(Watts): 62.5mW; Overload Voltage (Max): 50V; Temperature Coefficient: ±100ppm/℃; Operating Temperature Range: -55℃~+155℃
R179 = 0402WGF2001TCE: 电阻类型:厚膜电阻;阻值:2kΩ;精度:±1%;功率:62.5mW;最大工作电压:50V;温度系数:±100ppm/℃;; LCSC Part Name: 2kΩ ±1% 62.5mW 厚膜电阻; Supplier Part: C4109; Manufacturer: UNI-ROYAL(厚声); Supplier Footprint: 0402; JLCPCB Part Class: 基础库; Datasheet: https://atta.szlcsc.com/upload/public/pdf/source/20200306/C422600_1E6D84923E4A46A82E41ADD87F860B5C.pdf; Supplier: LCSC; Type: 厚膜电阻; Tolerance: ±1%; Power(Watts): 62.5mW; Overload Voltage (Max): 50V; Temperature Coefficient: ±100ppm/℃; Operating Temperature Range: -55℃~+155℃
R184 = 0603WAJ010LT5E: 电阻类型:厚膜电阻;阻值:10mΩ;精度:±5%;功率:100mW;工作电压:75V;温度系数:±1500ppm/℃;; LCSC Part Name: 10mΩ ±5% 100mW 厚膜电阻; Supplier Part: C620909; Manufacturer: UNI-ROYAL(厚声); Supplier Footprint: 0603; JLCPCB Part Class: 扩展库; Datasheet: https://atta.szlcsc.com/upload/public/pdf/source/20200306/C422600_1E6D84923E4A46A82E41ADD87F860B5C.pdf; Supplier: LCSC; Type: 厚膜电阻; Tolerance: ±5%; Power(Watts): 100mW; Voltage-Supply(Max): 75V; Temperature Coefficient: ±1500ppm/℃; Operating Temperature: -55℃~+155℃
RF2 = BWIPX-4-001E: 连接器类型:板端;接口类型:内针;端口数量:1;接口直径:1.5mm;接口长度/高度:-;频率-最大值:-;射频系列:IPEX;阻抗:-;样式:-;工作温度范围:-;; LCSC Part Name: IPEX 内针; Supplier Part: C784401; Manufacturer: BAT WIRELESS(蝙蝠无线); Supplier Footprint: SMD; JLCPCB Part Class: 扩展库; Datasheet: https://atta.szlcsc.com/upload/public/pdf/source/20200915/C784401_F782AD355A18B33ABEEDBC6CC33688E9.pdf; Supplier: LCSC; Connector Type: 板端; Interface Type: 内针; Number of Ports: 1; Interface Diameter: 1.5mm; RF Series: IPEX
S1 = AHT20: Supplier Part: C2757850; Manufacturer: 广州奥松; Supplier Footprint: SMD; JLCPCB Part Class: Extended Part; Datasheet: https://atta.szlcsc.com/upload/public/pdf/source/20231023/00557B34ED120268320A4810FF8DED4D.pdf; Supplier: LCSC
U2 = TP4056-42-ESOP8: 锂电池充电芯片 42代表电池满电电压4.2V。; Supplier Part: C16581; Manufacturer: TOPPOWER(南京拓微); Supplier Footprint: ESOP-8; JLCPCB Part Class: Extended Part; Datasheet: https://atta.szlcsc.com/upload/public/pdf/source/20190626/C16581_611BCF5D7CF554EAE465137A8F68DB3E.pdf; Supplier: LCSC
U3 = TLV521DCKR: 放大器数:单路;增益带宽积(GBP):6kHz;输入偏置电流(Ib):1pA;压摆率(SR):0.0025V/us;带宽(-3db):-;轨到轨:-;; Supplier Part: C655085; Manufacturer: TI(德州仪器); Supplier Footprint: SC-70-5; JLCPCB Part Class: Extended Part; Datasheet: https://www.ti.com/cn/lit/gpn/tlv521; Supplier: LCSC; Number of Circuits: 单路; Gain Bandwidth Product(GBP): 6kHz; Current - Input Bias(Ib): 1pA; Slew Rate(SR): 0.0025V/us; Output Current: 12mA; Operating Temperature: -40℃~+125℃
U16 = ESP32-C3FH4: Supplier Part: C2858491; Manufacturer: ESPRESSIF(乐鑫); Supplier Footprint: QFN-32-EP(5x5); JLCPCB Part Class: 扩展库; Datasheet: https://atta.szlcsc.com/upload/public/pdf/source/20231220/86199E4714F7A99F6AA9401EA48CDBDA.pdf; Supplier: LCSC
U17 = ML414H-IV01E: 4.8*1.4 3.1V可充电纽扣电池/1mAh/可无铅回流焊; LCSC Part Name: Seiko(精工) 锂离子电池 3V 1mAh 1个; Supplier Part: C167511; Manufacturer: Seiko(精工); JLCPCB Part Class: 扩展库; Datasheet: https://atta.szlcsc.com/upload/public/pdf/source/20240813/3753C7A82D2F6B2E19826E6DCCF42700.pdf; Supplier: LCSC
U20 = LIS3DHTR: 轴向:X,Y,Z;; Supplier Part: C15134; Manufacturer: ST(意法半导体); Supplier Footprint: LGA-16(3x3); JLCPCB Part Class: 扩展库; Datasheet: https://atta.szlcsc.com/upload/public/pdf/source/20170502/1493709336456.pdf; Supplier: LCSC; Axial Direction: X,Y,Z; Supply Voltage: 1.71V~3.6V; Operating Temperature: -40℃~+85℃
U21 = LIS2MDLTR: 磁传感器、数字输出、50高斯磁场动态范围、超低功耗、高性能、3轴磁力计; LCSC Part Name: 霍尔效应开关; Supplier Part: C919695; Manufacturer: ST(意法半导体); Supplier Footprint: LGA-12(2x2); JLCPCB Part Class: 扩展库; Datasheet: https://atta.szlcsc.com/upload/public/pdf/source/20211119/145E3A73C2A09E2C981D93C27CF540FA.pdf; Supplier: LCSC
U22 = 2.4Ghz_天线
U23 = BMP580: Supplier Part: C22391138; Manufacturer: Bosch(博世); Supplier Footprint: LGA-10(2x2); JLCPCB Part Class: 扩展库; Datasheet: https://atta.szlcsc.com/upload/public/pdf/source/20240724/E2D6053E980096703E6C36C0338E6FAD.pdf; Supplier: LCSC
U46 = ETA3425D2G: 功能类型:降压型;工作电压:2.6V~7V;输出电流:600mA;; Supplier Part: C7465549; Manufacturer: ETA(钰泰); Supplier Footprint: DFN2x2-6; JLCPCB Part Class: Extended Part; Datasheet: https://atta.szlcsc.com/upload/public/pdf/source/20230717/4FEEC72C84A7B303B210F98BCAAF2B0F.pdf; Supplier: LCSC; Function: 降压型; Input Voltage: 2.6V~7V; Output Current: 600mA; Switching Frequency: 1.4MHz; Operating Temperature: -40℃~+85℃; Synchronous Rectification: 是; Number of Outputs: 1; Topology: 降压式; Switch tube (built-in/external): 内置
U47 = SL197-1: 工作电压:1V~6V;电池类型:锂离子/聚合物;电池节数:1;; Supplier Part: C408266; Manufacturer: Slkor(萨科微); Supplier Footprint: DFN-6L(2x2); JLCPCB Part Class: 扩展库; Datasheet: https://atta.szlcsc.com/upload/public/pdf/source/20190729/C408266_61FCDE9FBE952BB99B692FFF6480F6BE.pdf; Supplier: LCSC; Voltage - Supply: 1V~6V; Charging Saturation Voltage: 4.275V; End-Off Voltage: 2.8V; Type of Battery: 锂离子/聚合物; Number of Cells: 1; Operating Temperature: -40℃~+85℃
U48 = BQ27220YZFR: 工作电压:2.45V~4.5V;电池类型:锂离子/聚合物;电池节数:1;; LCSC Part Name: 单节电池CEDV电量计; Supplier Part: C528617; Manufacturer: TI(德州仪器); Supplier Footprint: DSBGA-9; JLCPCB Part Class: 扩展库; Datasheet: https://www.ti.com/cn/lit/gpn/bq27220; Supplier: LCSC; The Chip Type: 电池监测芯片; Voltage - Supply: 2.45V~4.5V; Type of Battery: 锂离子/聚合物; Number of Cells: 1; Operating Temperature: -40℃~+85℃
USB1 = TYPE-C 16PIN 2MD(073): 连接器类型:Type-C;标准:-;公母:母;端口数量:1;触点数量:16P;安装方式:卧贴;额定电流 - 电源:5A;工作温度范围:-25℃~+85℃;; LCSC Part Name: Type-C 母 卧贴; Supplier Part: C2765186; Manufacturer: SHOU HAN(首韩); Supplier Footprint: SMD; JLCPCB Part Class: Extended Part; Datasheet: https://atta.szlcsc.com/upload/public/pdf/source/20211123/39B17C16241EAC15C5E277BDA434118E.pdf; Supplier: LCSC; Connector Type: Type-C; Gender: 母; Number of Ports: 1; Number of Contacts: 16P; Mounting Style: 卧贴; Current Rating - Power (Max): 5A; Operating Temperature Range: -25℃~+85℃
X3 = Q13FC13500004_C32346: 晶振类型:贴片晶振;频率:32.768kHz;常温频差:±20ppm;外接负载电容:12.5pF;; LCSC Part Name: 32.768kHz ±20ppm 12.5pF; Supplier Part: C32346; Manufacturer: EPSON(爱普生); Manufacturer Part: Q13FC13500004; Supplier Footprint: SMD3215-2P; JLCPCB Part Class: Basic Part; Datasheet: https://atta.szlcsc.com/upload/public/pdf/source/20240418/0E0FF5F0356BA3753F616001439D1416.pdf; Supplier: LCSC; Crystal Type: 贴片晶振; Normal temperature Frequency Tolerance: ±20ppm; External load capacitor: 12.5pF; Equivalent Series Resistance (ESR): 70kΩ; Operating Temperature: -40℃~+85℃
X4 = TXM40M0004252HBCEO00T: 晶振类型:贴片晶振;频率:40MHz;常温频差:±10ppm;外接负载电容:15pF;频率稳定度(全温):±30ppm;; LCSC Part Name: 40MHz ±10ppm 15pF; Supplier Part: C284176; Manufacturer: YJX(雅晶鑫); Supplier Footprint: SMD2520-4P; JLCPCB Part Class: 扩展库; Datasheet: https://atta.szlcsc.com/upload/public/pdf/source/20180910/C284176_7C227CDEF2A90AF7BF47AD2F9582364C.pdf; Supplier: LCSC; Crystal Type: 贴片晶振; Normal temperature Frequency Tolerance: ±10ppm; External load capacitor: 15pF; Frequency Stability(Full temperature range): ±30ppm; Equivalent Series Resistance (ESR): 25Ω; Operating Temperature: -40℃~+85℃
C7 = 0402B223K500NT: 容值:22nF;精度:±10%;额定电压:50V;温度系数:X7R;; LCSC Part Name: 22nF ±10% 50V; Supplier Part: C1532; Manufacturer: FH(风华); Supplier Footprint: 0402; JLCPCB Part Class: Basic Part; Datasheet: https://atta.szlcsc.com/upload/public/pdf/source/20200305/C486355_26A10D38EF8C2A5C37091D0039909270.pdf; Supplier: LCSC; Tolerance: ±10%; Voltage Rating: 50V; Temperature Coefficient: X7R
C13 C16-C18 = 1206B475K500NT: 容值:4.7uF;精度:±10%;额定电压:50V;材质(温度系数):X7R;; LCSC Part Name: 4.7uF ±10% 50V; Supplier Part: C29823; Manufacturer: FH(风华); Supplier Footprint: 1206; JLCPCB Part Class: Basic Part; Datasheet: https://atta.szlcsc.com/upload/public/pdf/source/20200305/C486355_26A10D38EF8C2A5C37091D0039909270.pdf; Supplier: LCSC; Tolerance: ±10%; Voltage Rated: 50V; Temperature Coefficient: X7R
C15 C76-C78 = CL31A226KAHNNNE: 容值:22uF;精度:±10%;额定电压:25V;材质(温度系数):X5R;; LCSC Part Name: 22uF ±10% 25V; Supplier Part: C12891; Manufacturer: SAMSUNG(三星); Supplier Footprint: 1206; JLCPCB Part Class: Basic Part; Datasheet: https://atta.szlcsc.com/upload/public/pdf/source/20160218/1457707763339.pdf; Supplier: LCSC; Tolerance: ±10%; Voltage Rated: 25V; Temperature Coefficient: X5R
C19-C26 = CL21A225KBQNNNE: 容值:2.2uF;精度:±10%;额定电压:50V;材质(温度系数):X5R;; LCSC Part Name: 2.2uF ±10% 50V; Supplier Part: C377773; Manufacturer: SAMSUNG(三星); Supplier Footprint: 0805; JLCPCB Part Class: Basic Part; Datasheet: https://atta.szlcsc.com/upload/public/pdf/source/20160218/1457707763339.pdf; Supplier: LCSC; Tolerance: ±10%; Voltage Rated: 50V; Temperature Coefficient: X5R
CN1 = WJ15EDGRC-3.81-2P: 连接器类型:板端/插座-闭口;固定方式:-;结构:1x2P;间距:3.81mm;颜色:-;安装方式:弯针;排数:1;每排PIN数:2;额定电流:8A;额定电压:300V;线规 - AWG:-;线规 - 平方毫米:-;触头材质:黄铜;触头镀层:锡;工作温度范围:-40℃~+105℃;焊接温度(最大值):-;; LCSC Part Name: 1x2P 3.81mm 排数:1 每排P数:2; Supplier Part: C8387; Manufacturer: KANGNEX(康奈克斯电气); Supplier Footprint: 弯插,P=3.81mm; JLCPCB Part Class: Extended Part; Datasheet: https://atta.szlcsc.com/upload/public/pdf/source/20191225/C8387_8EBAF10345D2762F0167C8753398EEFA.pdf; Supplier: LCSC; Connector Type: 板端/插座-闭口; Structure: 1x2P; Pitch: 3.81mm; Mounting Style: 弯针; Number of Pins: 2P; Number of Rows: 1; Number of PINs Per Row: 2; Current Rating (Max): 8A; Voltage Rating (Max): 300V; Contact Material: 黄铜; Contact Plating: 锡; Operating Temperature Range: -40℃~+105℃
CN2 = DZ254S-11-02-48: 插针结构:1x2P;间距:2.54mm;圆针/方针:方针;安装方式:立贴;排数:单排;总PIN位数:2P;; LCSC Part Name: 1x2P 间距:2.54mm 方针 立贴; Supplier Part: C5160785; Manufacturer: DEALON(德艺隆); Supplier Footprint: SMD,P=2.54mm; JLCPCB Part Class: 扩展库; Datasheet: https://atta.szlcsc.com/upload/public/pdf/source/20230921/FE4E6D7F32A2CD9B95B1709A1ADE25FC.pdf; Supplier: LCSC; Pin Structure: 1x2P; Pitch: 2.54mm; Circluar Pins/Square Pins: 方针; Mounting Type: 立贴; Number of Rows: 单排; Number of Pins: 2P
D22-D29 = 1N5819WS_C191023: 正向压降(Vf):600mV@1A;直流反向耐压(Vr):40V;平均整流电流(Io):1A;; LCSC Part Name: 电压:40V 电流:1A; Supplier Part: C191023; Manufacturer: Hottech(合科泰); Supplier Footprint: SOD-323; JLCPCB Part Class: 基础库; Datasheet: https://atta.szlcsc.com/upload/public/pdf/source/20220428/3CB86FD8D28D653594B4E35F9D5AEFD9.pdf; Supplier: LCSC; Forward Voltage (Vf@If): 600mV@1A; Reverse Voltage (Vr): 40V; Average Rectified Current (Io): 1A
J1 J2 = 2.54-1*10P针: 插针结构:1x10P;间距:2.54mm;行距:-;圆针/方针:方针;安装方式:直插;排数:单排;总PIN位数:10P;额定电流:3A;额定电压:-;配合针长度:-;塑高:-;端接针长度:-;触头材质:-;触头镀层:-;工作温度:-40℃~+105℃;颜色:黑色;; LCSC Part Name: 1x10P 间距:2.54mm 方针 直插; Supplier Part: C57369; Manufacturer: BOOMELE(博穆精密); Supplier Footprint: 插件,P=2.54mm; JLCPCB Part Class: Extended Part; Datasheet: https://atta.szlcsc.com/upload/public/pdf/source/20151109/1457707572883.pdf; Supplier: LCSC; Pin Structure: 1x10P; Pitch: 2.54mm; Circluar Pins/Square Pins: 方针; Mounting Type: 直插; Number of Rows: 单排; Number of Pins: 10P; Current Rating: 3A; Operating Temperature: -40℃~+105℃; Color: 黑色
Q9 = SQ7414CENW-T1_GE3: 类型:1个N沟道;漏源电压(Vdss):60V;连续漏极电流(Id):18A;导通电阻(RDS(on)@Vgs,Id):23mΩ@10V,8.7A;功率(Pd):62W;阈值电压(Vgs(th)@Id):2.5V@250uA;; LCSC Part Name: 1个N沟道 耐压:60V 电流:18A; Supplier Part: C727497; Manufacturer: VISHAY(威世); Supplier Footprint: PowerPAK-1212-8W; JLCPCB Part Class: Extended Part; Datasheet: https://atta.szlcsc.com/upload/public/pdf/source/20210325/C727497_1473C8973180B559D4252343AEF5DA70.pdf; Supplier: LCSC; Type: 1个N沟道; Drain Source Voltage (Vdss): 60V; Continuous Drain Current (Id): 18A; Drain Source On Resistance (RDS(on)@Vgs,Id): 23mΩ@10V,8.7A; Power Dissipation (Pd): 62W; Gate Threshold Voltage (Vgs(th)@Id): 2.5V@250uA; Total Gate Charge (Qg@Vgs): 25nC@10V; Input Capacitance (Ciss@Vds): 1.59nF@30V; Reverse Transfer Capacitance (Crss@Vds): 52pF@30V; Operating Temperature: -55℃~+175℃
Q13 Q15 = AO3400A_C20917: 类型:1个N沟道;漏源电压(Vdss):30V;连续漏极电流(Id):5.7A;导通电阻(RDS(on)@Vgs,Id):26.5mΩ@10V,5.7A;功率(Pd):1.4W;阈值电压(Vgs(th)@Id):1.5V@250uA;; LCSC Part Name: 1个N沟道 耐压:30V 电流:5.7A; Supplier Part: C20917; Manufacturer: AOS; Supplier Footprint: SOT-23-3L; JLCPCB Part Class: 基础库; Datasheet: https://atta.szlcsc.com/upload/public/pdf/source/20140107/1457706668533.pdf; Supplier: LCSC; Type: 1个N沟道; Drain Source Voltage (Vdss): 30V; Continuous Drain Current (Id): 5.7A; Drain Source On Resistance (RDS(on)@Vgs,Id): 26.5mΩ@10V,5.7A; Power Dissipation (Pd): 1.4W; Gate Threshold Voltage (Vgs(th)@Id): 1.5V@250uA; Total Gate Charge (Qg@Vgs): 7nC@4.5V; Input Capacitance (Ciss@Vds): 630pF@15V; Operating Temperature: -55℃~+150℃@(Tj)
Q14 = 2N7002_C8545: 类型:1个N沟道;漏源电压(Vdss):60V;连续漏极电流(Id):115mA;导通电阻(RDS(on)@Vgs,Id):5Ω@10V;功率(Pd):225mW;阈值电压(Vgs(th)@Id):2.5V@250uA;; LCSC Part Name: 1个N沟道 耐压:60V 电流:115mA; Supplier Part: C8545; Manufacturer: CJ(江苏长电/长晶); Supplier Footprint: SOT-23; JLCPCB Part Class: Basic Part; Datasheet: https://atta.szlcsc.com/upload/public/pdf/source/20171228/C164913_15144413269051213916.pdf; Supplier: LCSC; Type: 1个N沟道; Drain Source Voltage (Vdss): 60V; Continuous Drain Current (Id): 115mA; Power Dissipation (Pd): 225mW; Drain Source On Resistance (RDS(on)@Vgs,Id): 5Ω@10V; Gate Threshold Voltage (Vgs(th)@Id): 2.5V@250uA; Input Capacitance (Ciss@Vds): 50pF; Operating Temperature: -55℃~+150℃; Reverse Transfer Capacitance (Crss@Vds): 5pF
R19 = 0402WGF5102TCE: 电阻类型:厚膜电阻;阻值:51kΩ;精度:±1%;功率:62.5mW;最大工作电压:50V;温度系数:±100ppm/℃;; LCSC Part Name: 51kΩ ±1% 62.5mW 厚膜电阻; Supplier Part: C25794; Manufacturer: UNI-ROYAL(厚声); Supplier Footprint: 0402; JLCPCB Part Class: Basic Part; Datasheet: https://atta.szlcsc.com/upload/public/pdf/source/20200306/C422600_1E6D84923E4A46A82E41ADD87F860B5C.pdf; Supplier: LCSC; Type: 厚膜电阻; Tolerance: ±1%; Power(Watts): 62.5mW; Overload Voltage (Max): 50V; Temperature Coefficient: ±100ppm/℃; Operating Temperature Range: -55℃~+155℃
R20 = 0805W8F0000T5E: 电阻类型:厚膜电阻;阻值:0Ω;精度:±1%;功率:125mW;最大工作电压:150V;温度系数:±800ppm/℃;; LCSC Part Name: 0Ω ±1% 125mW 厚膜电阻; Supplier Part: C17477; Manufacturer: UNI-ROYAL(厚声); Supplier Footprint: 0805; JLCPCB Part Class: Basic Part; Datasheet: https://atta.szlcsc.com/upload/public/pdf/source/20200306/C422600_1E6D84923E4A46A82E41ADD87F860B5C.pdf; Supplier: LCSC; Type: 厚膜电阻; Tolerance: ±1%; Power(Watts): 125mW; Overload Voltage (Max): 150V; Temperature Coefficient: ±800ppm/℃; Operating Temperature Range: -55℃~+155℃
R21 = 0402WGF4701TCE: 电阻类型:厚膜电阻;阻值:4.7kΩ;精度:±1%;功率:62.5mW;最大工作电压:50V;温度系数:±100ppm/℃;; LCSC Part Name: 4.7kΩ ±1% 62.5mW 厚膜电阻; Supplier Part: C25900; Manufacturer: UNI-ROYAL(厚声); Supplier Footprint: 0402; JLCPCB Part Class: Basic Part; Datasheet: https://atta.szlcsc.com/upload/public/pdf/source/20200306/C422600_1E6D84923E4A46A82E41ADD87F860B5C.pdf; Supplier: LCSC; Type: 厚膜电阻; Tolerance: ±1%; Power(Watts): 62.5mW; Overload Voltage (Max): 50V; Temperature Coefficient: ±100ppm/℃; Operating Temperature Range: -55℃~+155℃
R23 = 1206W4F1004T5E: 电阻类型:厚膜电阻;阻值:1MΩ;精度:±1%;功率:250mW;最大工作电压:200V;温度系数:±100ppm/℃;; LCSC Part Name: 1MΩ ±1% 250mW 厚膜电阻; Supplier Part: C17927; Manufacturer: UNI-ROYAL(厚声); Supplier Footprint: 1206; JLCPCB Part Class: Basic Part; Datasheet: https://atta.szlcsc.com/upload/public/pdf/source/20200306/C422600_1E6D84923E4A46A82E41ADD87F860B5C.pdf; Supplier: LCSC; Type: 厚膜电阻; Tolerance: ±1%; Power(Watts): 250mW; Overload Voltage (Max): 200V; Temperature Coefficient: ±100ppm/℃; Operating Temperature Range: -55℃~+155℃
R24 = 0603WAF7501T5E: 电阻类型:厚膜电阻;阻值:7.5kΩ;精度:±1%;功率:100mW;最大工作电压:75V;温度系数:±100ppm/℃;; LCSC Part Name: 7.5kΩ ±1% 100mW 厚膜电阻; Supplier Part: C23234; Manufacturer: UNI-ROYAL(厚声); Supplier Footprint: 0603; JLCPCB Part Class: Basic Part; Datasheet: https://atta.szlcsc.com/upload/public/pdf/source/20200306/C422600_1E6D84923E4A46A82E41ADD87F860B5C.pdf; Supplier: LCSC; Type: 厚膜电阻; Tolerance: ±1%; Power(Watts): 100mW; Overload Voltage (Max): 75V; Temperature Coefficient: ±100ppm/℃; Operating Temperature Range: -55℃~+155℃
R25 R63 R173 R174 = 0402WGF0000TCE: 电阻类型:厚膜电阻;阻值:0Ω;精度:±1%;功率:62.5mW;最大工作电压:50V;温度系数:±800ppm/℃;; LCSC Part Name: 0Ω ±1% 62.5mW 厚膜电阻; Supplier Part: C17168; Manufacturer: UNI-ROYAL(厚声); Supplier Footprint: 0402; JLCPCB Part Class: Basic Part; Datasheet: https://atta.szlcsc.com/upload/public/pdf/source/20200306/C422600_1E6D84923E4A46A82E41ADD87F860B5C.pdf; Supplier: LCSC; Type: 厚膜电阻; Tolerance: ±1%; Power(Watts): 62.5mW; Overload Voltage (Max): 50V; Temperature Coefficient: ±800ppm/℃; Operating Temperature Range: -55℃~+155℃
U5 = LM3478MMX/NOPB: 电源电压:2.97V~40V;开关频率:100kHz~1MHz;; Supplier Part: C404045; Manufacturer: TI(德州仪器); Supplier Footprint: VSSOP-8-0.65mm; JLCPCB Part Class: Extended Part; Datasheet: https://www.ti.com/cn/lit/gpn/lm3478; Supplier: LCSC; Supply Voltage: 2.97V~40V; Switching Frequency: 100kHz~1MHz; Duty Cycle: 100%; Topology: 反激式；升压式；SEPIC; Operating Temperature: -40℃~+125℃@(Tj)

## Nets
DGND: C54.1 C56.1 C59.1 C61.1 C62.1 C63.1 C66.1 C68.1 C70.1 C71.1 C72.1 C73.1 C74.1 C75.1 C152.1 C153.1 C155.1 C156.1 C157.1 C158.1 C160.1 C161.1 C162.1 C168.1 D16.3(K) D17.1 H2.1 KEY5.1 Q16.2(S) R2.1 R15.1 R56.1 R57.2 R61.1 R151.2 R157.2 R160.2 R162.2 R170.2 R172.2 R175.2 RF2.2 RF2.3 RF2.4 S1.2(GND) U3.2(V-) U16.33(EP) U17.2 U20.5(GND) U20.10(RES) U20.12(GND) U21.6(GND) U21.8(GND) U22.1(GND) U23.3(VSS) U23.8(VSS) U23.9(VSS) USB1.1(GND) USB1.12(GND) USB1.13(SHELL) USB1.14(SHELL) X4.2 X4.4
GNDBADC: C166.1 C169.1 R183.1 R189.2 U48.B2(VSS)
GNDBAT: C2.1 C3.1 C164.2 KEY7.1 R4.1 R7.1 R10.1 R16.1 R59.1 R60.1 R61.2 R145.2 R175.1 R176.2 R179.1 R182.2 R189.1 U2.3(GND) U2.9(EP) U47.2(S1) U47.3(S1)
GNDBAT_EXT: C84.2 F1.1 FPC1.2 FPC1.3 FPC1.4
PGND: C15.1 C76.1 C77.1 C78.1 C82.1 C163.1 CN1.2 Q15.2(S) R20.1 R21.1 R24.1 R57.1 R59.2 R152.1 R188.1 U5.4(AGND) U5.5(PGND)
VCC+170V: C21.2 CN2.1 D28.1(K) R23.2
VCCBAT+4V2: C2.2 Q11.3(D) R9.2 R184.2 U2.5(BAT) U48.C2(SRN)
VCCBOOST+5V: C77.2 C78.2 CN1.1 L2.1 R148.2
VCCBOOSTCTR+5V: C163.2 Q14.3(D) R29.2 R173.1 U5.8(VIN)
VCCBUCK: C150.2 R146.2 U46.5(VIN)
VCCL+3V3: J1.4 Q13.2(S)
VCCMCU+3V3: C59.2 C66.2 C68.2 C70.2 C152.2 C153.2 C155.2 C156.2 C158.2 C160.2 C161.2 C162.2 D34.2(+) D35.2(+) H1.1 Q2.2(S) Q13.3(D) R17.2 R42.1 R45.1 R161.2 R163.1 R164.2 R165.1 R166.1 R169.1 R171.1 S1.5(VDD) U3.5(V+) U16.2(VDD3P3) U16.3(VDD3P3) U16.17(VDD3P3_CPU) U16.18(VDD_SPI) U16.31(VDDA) U16.32(VDDA) U20.1(VDD_IO) U20.14(VDD) U21.9(Vdd) U21.10(Vdd_IO) U23.1(VDDIO) U23.10(VDD)
VCCSYS+5V: D33.2(K) Q1.2(S) Q11.2(S) R14.2 R146.1 R148.1 R173.2
VCCTYPEC: C74.2 D17.2 R147.1 USB1.2(VBUS) USB1.11(VBUS)
VCCUSB: C3.2 D33.1(A) LED1.2(A) LED2.2(A) Q11.1(G) R3.2 R145.1 R147.2 U2.4(VCC) U2.8(CE)
BATALT: R181.1 U48.A1(GPOUT)
BATTERYMCUADC: R8.1 U3.1(OUT) U3.4(IN-) U16.8(GPIO3)
BGND: C150.1 C151.1 R60.2 R129.2 R160.1 U46.6(GND) U46.7(EP)
BOOSTEN: Q14.1(G) R174.2
BUCK+3V3: C151.2 L1.2 L19.2 R128.1 R161.1
LCLK: R154.2 U16.13(MTDO)
LDQ: R155.2 U16.12(MTCK)
LLOCK: R153.2 U16.14(GPIO8)
LOOFF: Q16.3(D) R186.1
LPGND: CN2.2 J1.5 J1.6 J1.7 J1.8 J2.5 J2.6 J2.7 J2.8 R151.1 R152.2
POWER3V3EN: D2.1(-) Q1.3(D) R16.2 R181.2 R186.2 U46.4(EN)
POWERLLEN: H1.2 Q13.1(G) R157.1 R174.1 U16.16(GPIO10)
POWERMCUCTLR: C75.2 D2.2(+) R17.1 U16.9(MTMS)
POWERMCUKEY: Q2.3(D) R15.2 R187.2 U16.10(MTDI)
REST: C56.2 H2.2 R149.2 R191.1 U16.7(CHIP_EN)
SCL: R48.2 R165.2 S1.6(SCL) U16.4(XTAL_32K_P) U20.4(SCL/SPC) U21.1(SCL/SPC) U23.2(SCK) U48.A3(SCL)
SDA: R49.2 R164.1 S1.1(SDA) U16.5(XTAL_32K_N) U20.6(SDA/SDI/SDO) U21.4(SDA/SDI/SDO) U23.4(SDI) U48.A2(SDA)
USBDN: D16.2(A1) R41.1 USB1.5(DN2) USB1.7(DN1)
USBDP: D16.1(A1) R40.1 USB1.6(DP1) USB1.8(DP2)
$5N13: R19.2 U5.7(FA/SD)
$5N14: R18.1 U5.6(DR)
$5N17: C7.2 U5.2(COMP)
$5N18: C7.1 R21.2
$5N72: C15.2 C16.1 C76.2 D18.1(A) D30.2(K) R25.2
$5N126: R23.1 R24.2 R25.1 U5.3(FB)
$5N128: C13.2 D18.2(K) D19.1(A)
$5N132: C18.2 D20.1(A) D21.2(K)
$5N134: C19.2 C25.1 D25.2(A) D29.1(K)
$5N135: C20.2 D22.1(K) D29.2(A)
$5N138: C22.2 D23.1(K) D28.2(A)
$5N139: C21.1 C23.2 D23.2(A) D27.1(K)
$5N140: C24.2 D24.1(K) D27.2(A)
$5N141: C23.1 C25.2 D24.2(A) D26.1(K)
$5N142: C26.2 D25.1(K) D26.2(A)
$5N1401: Q15.3(D) R19.1 R29.1
$5N6170: C16.2 C17.1 D19.2(K) D21.1(A)
$5N6511: C17.2 C19.1 D20.2(K) D22.2(A)
$5N17165: R63.2 U5.1(ISEN)
$5N21701: C82.2 Q9.1(S) Q9.2(S) Q9.3(S) R20.2 R63.1
$5N21732: Q9.4(G) R18.2
$5N31455: C13.1 C18.1 C20.1 C22.1 C24.1 C26.1 D30.1(A) L2.2 Q9.5(D) Q9.6(D) Q9.7(D) Q9.8(D) Q9.9(D)
$5N31990: J1.1 R153.1
$5N31997: J1.2 R154.1
$5N32004: J1.3 R155.1
$5N44028: Q14.2(S) Q15.1(G) R188.2
$7N6323: L15.2 U16.1(LNA_IN)
$7N6352: R40.2 R42.2 U16.26(GPIO19)
$7N6426: C72.2 U16.29(XTAL_N) X4.1(OSC1)
$7N6435: R41.2 U16.25(GPIO18)
$7N6986: C73.2 KEY5.2 R45.2 U16.15(GPIO9)
$7N24444: C54.2 C83.1 L15.1 U22.2(RF)
$7N25625: C83.2 RF2.1
$7N28063: C1.1 C165.1 D1.1 F1.2 Q12.1(G) R182.1 U47.4(S2) U47.5(S2)
$7N28074: R3.1 R4.2 U2.1(TEMP)
$7N28076: LED1.1(C) R5.1
$7N28077: R6.2 U2.7(CHRG#)
$7N28078: R5.2 U2.6(STDBY#)
$7N28080: R7.2 U2.2(PROG)
$7N28081: LED2.1(C) R6.1
$7N28100: R2.2 USB1.4(CC1)
$7N28101: R56.2 USB1.10(CC2)
$7N28121: C1.2 C84.1 D1.2 FPC1.1 Q12.2(S)
$7N28604: KEY7.2 Q1.1(G) Q2.1(G) R14.1 R176.1
$7N34810: R159.1 U16.30(XTAL_P)
$7N34817: C71.2 R159.2 X4.3(OSC2)
$7N35250: L1.1 L19.1 U46.1(SW)
$7N35253: R128.2 R129.1 U46.3(FB)
$7N36990: R171.2 R172.1 U23.5(SDO)
$7N37153: R169.2 R170.1 U23.6(CSB)
$7N47928: R179.2 U47.1(VM)
$7N48528: C166.2 U48.B3(VDD)
$7N48606: R183.2 U48.B1(BIN)
$7N49212: C168.2 Q16.1(G) R187.1
$7N49691: C169.2 Q12.3(D) R178.1 R184.1 U48.C1(SRP) U48.C3(BAT)
$7N49697: C165.2 R178.2 U47.6(VCC)
$7N60752: D34.1(-) R190.1
$7N60914: C61.2 R190.2 R191.2 U16.11(VDD3P3_RTC) U17.1
$7N60996: D35.1(-) R149.1
Net-(C62-2): C62.2 R49.1 X3.2
Net-(C63-2): C63.2 R48.1 X3.1
Net-(C157-2): C157.2 U21.5(C1)
Net-(C164-1): C164.1 R8.2 R9.1 R10.2 U3.3(IN+)
Net-(R162-1): R162.1 U20.7(SDO/SA0)
Net-(R163-2): R163.2 U20.8(CS)
Net-(R166-2): R166.2 U21.3(CS)

Not connected (* = marked no-connect by the designer): J1 9* 10*; J2 1* 2* 3* 4* 9* 10*; KEY5 3; KEY7 3; S1 3(NC) 4(NC); U16 6(GPIO2) 19(SPIHD) 20(SPIWP) 21(SPICS0) 22(SPICLK) 23(SPID) 24(SPIQ) 27(U0RXD) 28(U0TXD); U20 2(NC) 3(NC) 9(INT2) 11(INT1) 13(ADC3) 15(ADC2) 16(ADC1); U21 2(NC) 7(INT/DRDY/SDO) 11(NC) 12(NC); U23 7(INT); U46 2(NC); U47 7(EP1) 8(EP2); USB1 3(SBU2) 9(SBU1)
